# Altium schematic sheet sensorModel.SchDoc: 传感器模块
size A4; Author: 潘全星; DocumentNumber: 03
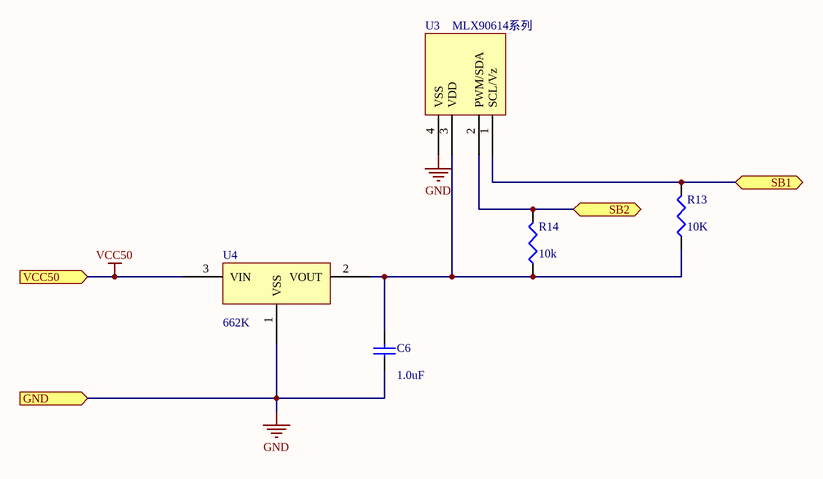
[diagram p0: sensorModel.SchDoc]

## Parts
C6  value 1.0uF  [cap-0805]
R13  value 10K  [RES-1206]
R14  value 10k  [RES-1206]
U3  MLX90614系列  [MLX90614XCX]
U4  662K  [SOT23-3_L]

## Ports
GND (in), SB1 (bidir), SB2 (bidir), VCC50 (in)

## Nets
GND: C6.1 U3.4(VSS) U4.1(VSS) ; port GND
VCC50: U4.3(VIN) ; port VCC50
SB1: R13.2 U3.1(SCL/Vz) ; port SB1
SB2: R14.2 U3.2(PWM/SDA) ; port SB2
NetC6_2: C6.2 R13.1 R14.1 U3.3(VDD) U4.2(VOUT)

## Notes on the sheet
- Title
- Size:
- Date:
- A4
- Number:
- Time:
- Revision:
- Sheet
- of
- File:

## Library data of the parts
C6 = Cap: Capacitor; Published: 8-Jun-2000; LatestRevisionDate: 17-Jul-2002; LatestRevisionNote: Re-released for DXP Platform.; PackageReference: RAD-0.3; Publisher: Altium Limited; PackageDescription: Radial Cap, Thru-Hole; 2 Leads; 0.3 in Pin Spacing
R13 R14 = Res3: Resistor; Published: 8-Jun-2000; LatestRevisionDate: 29-May-2009; LatestRevisionNote: IPC-7351 Footprint Added.; PackageReference: J1-0603; Publisher: Altium Limited; PackageDescription: Chip Resistor
U3 = MLX90614系列: 迈来芯高精度红外测温传感器